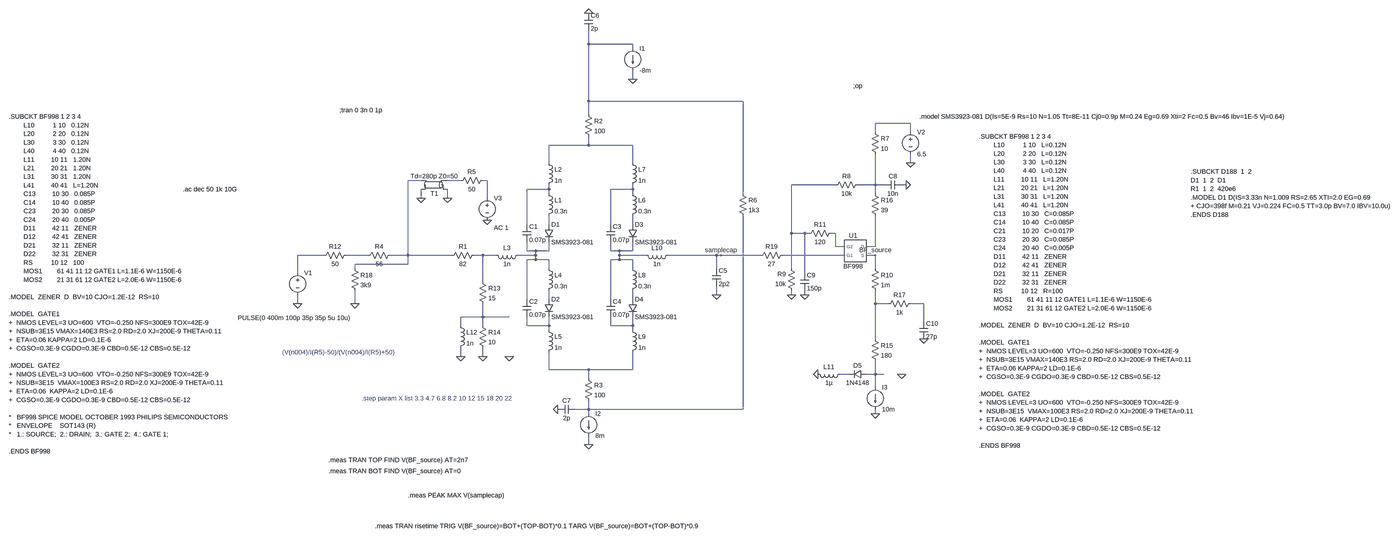
[diagram p0: schematic Draft17.asc, whole sheet]
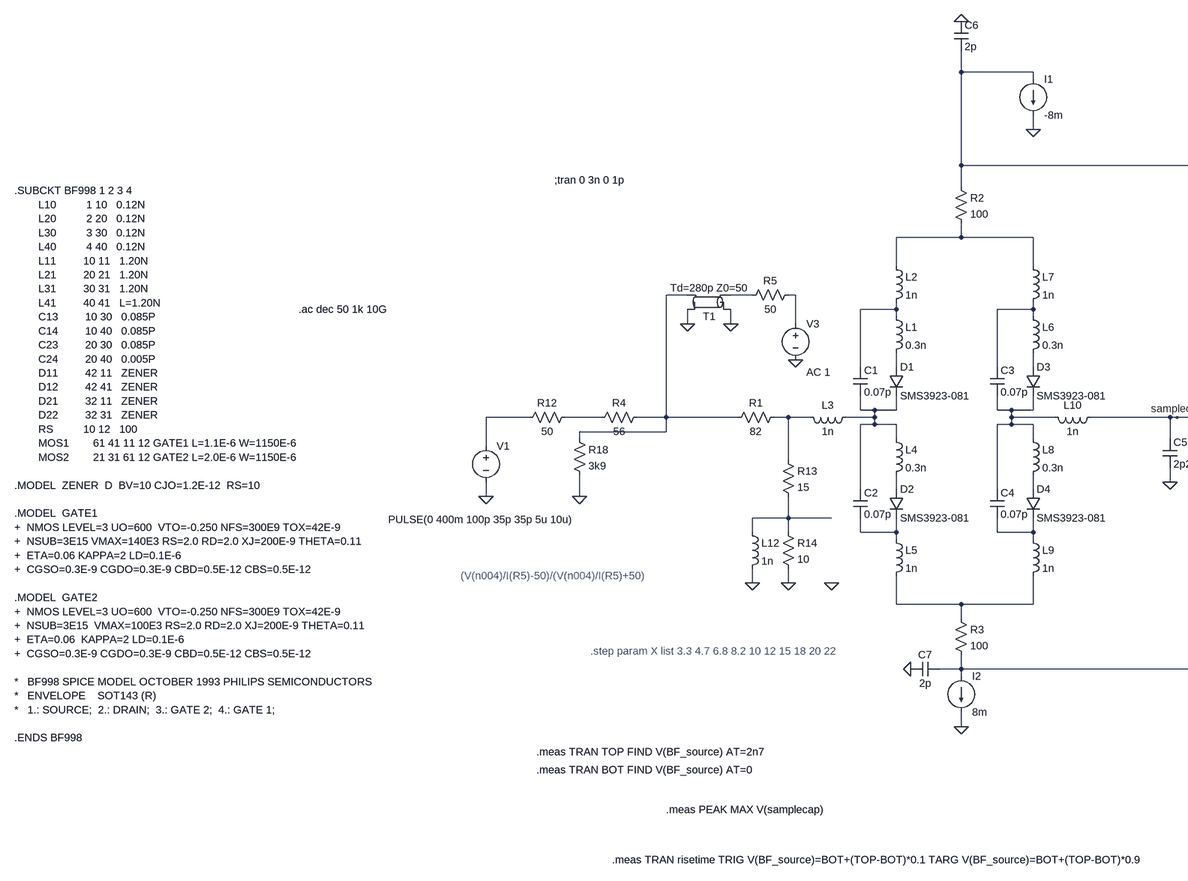
[diagram p1: schematic Draft17.asc, part, row 1 of 1, column 1 of 2]
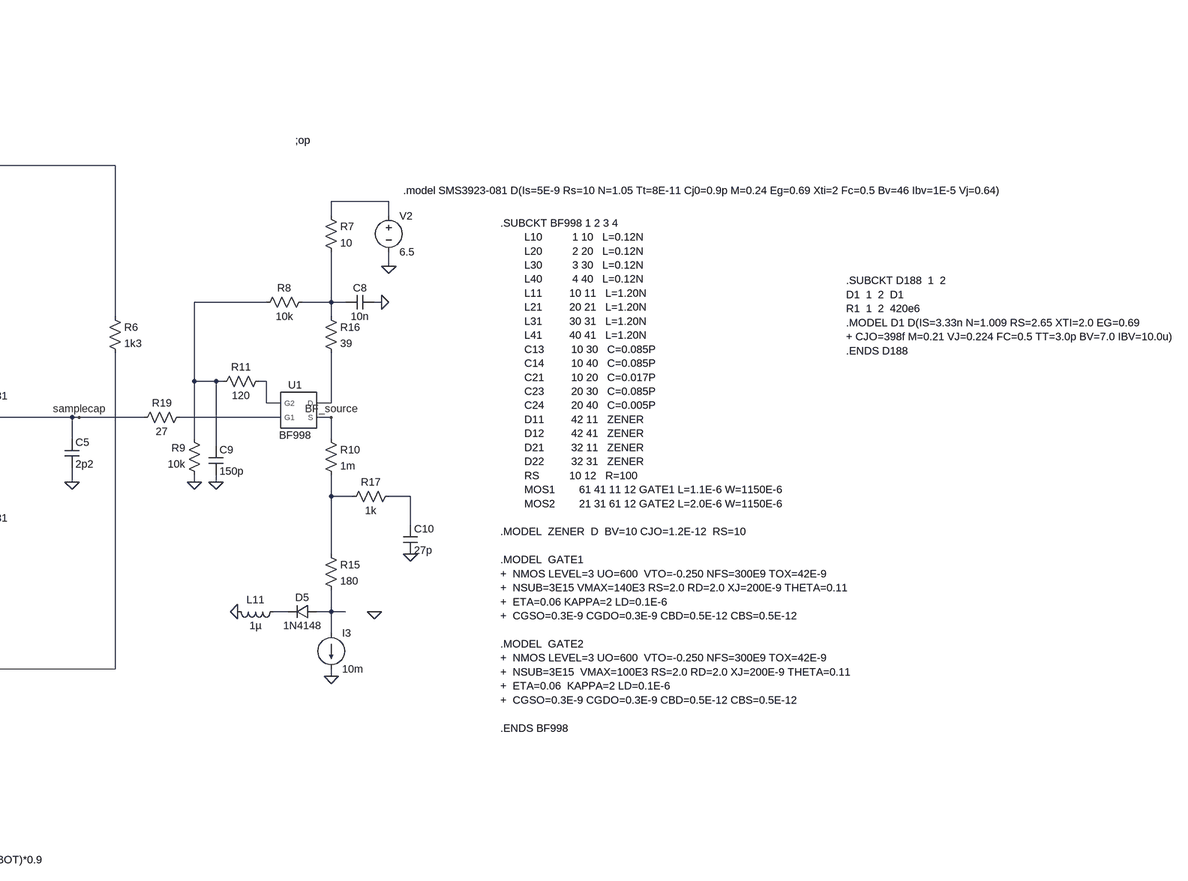
[diagram p2: schematic Draft17.asc, part, row 1 of 1, column 2 of 2]
Draft17.asc, the LTspice schematic file:
Version 4
SHEET 1 2144 1512
WIRE -832 -256 -832 -304
WIRE -672 -256 -832 -256
WIRE -672 -240 -672 -256
WIRE -672 -128 -672 -160
WIRE -832 -48 -832 -256
WIRE -272 -48 -832 -48
WIRE -832 0 -832 -48
WIRE 336 32 208 32
WIRE 208 64 208 32
WIRE 336 64 336 32
WIRE -832 112 -832 80
WIRE -832 112 -976 112
WIRE -672 112 -832 112
WIRE -976 176 -976 112
WIRE -672 176 -672 112
WIRE 336 176 336 144
WIRE -1440 240 -1488 240
WIRE -1296 240 -1344 240
WIRE -1200 240 -1216 240
WIRE 64 256 -96 256
WIRE 208 256 208 144
WIRE 208 256 144 256
WIRE 240 256 208 256
WIRE 320 256 304 256
WIRE -976 272 -976 256
WIRE -976 272 -1056 272
WIRE -672 272 -672 256
WIRE -672 272 -752 272
WIRE -976 288 -976 272
WIRE -672 288 -672 272
WIRE -272 288 -272 -48
WIRE 208 288 208 256
WIRE -1440 304 -1440 272
WIRE -1344 304 -1344 272
WIRE -1200 304 -1200 240
WIRE -1056 400 -1056 272
WIRE -976 400 -976 368
WIRE -752 400 -752 272
WIRE -672 400 -672 368
WIRE -96 432 -96 256
WIRE -48 432 -96 432
WIRE -32 432 -48 432
WIRE 64 432 48 432
WIRE 64 480 64 432
WIRE 96 480 64 480
WIRE 208 480 208 368
WIRE 208 480 176 480
WIRE -1056 496 -1056 464
WIRE -1024 496 -1056 496
WIRE -976 496 -976 464
WIRE -976 496 -1024 496
WIRE -752 496 -752 464
WIRE -720 496 -752 496
WIRE -672 496 -672 464
WIRE -672 496 -720 496
WIRE -1792 512 -1888 512
WIRE -1632 512 -1712 512
WIRE -1488 512 -1488 240
WIRE -1488 512 -1552 512
WIRE -1328 512 -1488 512
WIRE -1216 512 -1248 512
WIRE -1168 512 -1216 512
WIRE -1024 512 -1024 496
WIRE -1024 512 -1088 512
WIRE -720 512 -720 496
WIRE -624 512 -720 512
WIRE -368 512 -544 512
WIRE -352 512 -368 512
WIRE -208 512 -352 512
WIRE 96 512 -128 512
WIRE 208 512 176 512
WIRE -1024 528 -1024 512
WIRE -1024 528 -1056 528
WIRE -976 528 -1024 528
WIRE -720 528 -720 512
WIRE -720 528 -752 528
WIRE -672 528 -720 528
WIRE -1488 544 -1488 512
WIRE -1488 544 -1680 544
WIRE -1680 560 -1680 544
WIRE -976 560 -976 528
WIRE -672 560 -672 528
WIRE -368 560 -368 512
WIRE -96 560 -96 432
WIRE 208 560 208 512
WIRE -1888 576 -1888 512
WIRE -48 576 -48 432
WIRE -1216 608 -1216 512
WIRE -368 656 -368 624
WIRE -96 656 -96 640
WIRE -48 656 -48 640
WIRE -1056 672 -1056 528
WIRE -976 672 -976 640
WIRE -752 672 -752 528
WIRE -672 672 -672 640
WIRE -1888 688 -1888 656
WIRE -1680 688 -1680 640
WIRE 208 688 208 640
WIRE 256 688 208 688
WIRE 384 688 336 688
WIRE -1216 736 -1216 688
WIRE -1216 736 -1296 736
WIRE -1120 736 -1216 736
WIRE 384 752 384 688
WIRE -1296 768 -1296 736
WIRE -1216 768 -1216 736
WIRE -1056 768 -1056 736
WIRE -976 768 -976 736
WIRE -976 768 -1056 768
WIRE -752 768 -752 736
WIRE -672 768 -672 736
WIRE -672 768 -752 768
WIRE -976 784 -976 768
WIRE -672 784 -672 768
WIRE 208 816 208 688
WIRE -1296 880 -1296 848
WIRE -1216 880 -1216 848
WIRE -976 928 -976 864
WIRE -832 928 -976 928
WIRE -672 928 -672 864
WIRE -672 928 -832 928
WIRE 112 944 80 944
WIRE 208 944 208 896
WIRE 208 944 176 944
WIRE 240 944 208 944
WIRE -832 960 -832 928
WIRE 208 992 208 944
WIRE -832 1072 -832 1040
WIRE -832 1072 -880 1072
WIRE -272 1072 -272 368
WIRE -272 1072 -832 1072
WIRE -832 1088 -832 1072
WIRE 208 1088 208 1072
WIRE -832 1200 -832 1168
FLAG -368 656 0
FLAG -1888 688 0
FLAG -1440 304 0
FLAG -1344 304 0
FLAG -672 -128 0
FLAG -832 1200 0
FLAG -832 -368 0
FLAG -944 1072 0
FLAG -96 656 0
FLAG 320 256 0
FLAG -48 656 0
FLAG 336 176 0
FLAG 208 1088 0
FLAG -1216 880 0
FLAG -1296 880 0
FLAG 384 816 0
FLAG -352 512 samplecap
FLAG 304 944 0
FLAG 208 512 BF_source
FLAG 0 944 0
FLAG -1120 880 0
FLAG -1200 384 0
FLAG -1680 688 0
SYMBOL diode -992 400 R0
SYMATTR InstName D1
SYMATTR Value SMS3923-081
SYMBOL ind -992 272 R0
SYMATTR InstName L1
SYMATTR Value 0.3n
SYMBOL cap -1072 400 R0
SYMATTR InstName C1
SYMATTR Value 0.07p
SYMBOL ind -992 160 R0
SYMATTR InstName L2
SYMATTR Value 1n
SYMBOL ind -1072 496 R90
WINDOW 0 5 56 VBottom 2
WINDOW 3 32 56 VTop 2
SYMATTR InstName L3
SYMATTR Value 1n
SYMBOL diode -992 672 R0
SYMATTR InstName D2
SYMATTR Value SMS3923-081
SYMBOL ind -992 544 R0
SYMATTR InstName L4
SYMATTR Value 0.3n
SYMBOL cap -1072 672 R0
SYMATTR InstName C2
SYMATTR Value 0.07p
SYMBOL ind -992 768 R0
SYMATTR InstName L5
SYMATTR Value 1n
SYMBOL diode -688 400 R0
SYMATTR InstName D3
SYMATTR Value SMS3923-081
SYMBOL ind -688 272 R0
SYMATTR InstName L6
SYMATTR Value 0.3n
SYMBOL cap -768 400 R0
SYMATTR InstName C3
SYMATTR Value 0.07p
SYMBOL ind -688 160 R0
SYMATTR InstName L7
SYMATTR Value 1n
SYMBOL diode -688 672 R0
SYMATTR InstName D4
SYMATTR Value SMS3923-081
SYMBOL ind -688 544 R0
SYMATTR InstName L8
SYMATTR Value 0.3n
SYMBOL cap -768 672 R0
SYMATTR InstName C4
SYMATTR Value 0.07p
SYMBOL ind -688 768 R0
SYMATTR InstName L9
SYMATTR Value 1n
SYMBOL ind -528 496 R90
WINDOW 0 5 56 VBottom 2
WINDOW 3 32 56 VTop 2
SYMATTR InstName L10
SYMATTR Value 1n
SYMBOL cap -384 560 R0
SYMATTR InstName C5
SYMATTR Value 2p2
SYMBOL res -1232 496 R90
WINDOW 0 0 56 VBottom 2
WINDOW 3 32 56 VTop 2
SYMATTR InstName R1
SYMATTR Value 82
SYMBOL res -848 -16 R0
SYMATTR InstName R2
SYMATTR Value 100
SYMBOL res -848 944 R0
SYMATTR InstName R3
SYMATTR Value 100
SYMBOL voltage -1888 560 R0
WINDOW 123 0 0 Left 0
WINDOW 39 0 0 Left 0
WINDOW 3 -217 179 Left 2
SYMATTR Value PULSE(0 400m 100p 35p 35p 5u 10u)
SYMATTR InstName V1
SYMBOL res -1536 496 R90
WINDOW 0 0 56 VBottom 2
WINDOW 3 32 56 VTop 2
SYMATTR InstName R4
SYMATTR Value 56
SYMBOL tline -1392 256 R180
SYMATTR InstName T1
SYMATTR Value Td=280p Z0=50
SYMBOL current -672 -240 R0
WINDOW 123 0 0 Left 0
WINDOW 39 0 0 Left 0
SYMATTR InstName I1
SYMATTR Value -8m
SYMBOL current -832 1088 R0
WINDOW 123 0 0 Left 0
WINDOW 39 0 0 Left 0
SYMATTR InstName I2
SYMATTR Value 8m
SYMBOL cap -848 -368 R0
SYMATTR InstName C6
SYMATTR Value 2p
SYMBOL cap -944 1088 R270
WINDOW 0 32 32 VTop 2
WINDOW 3 0 32 VBottom 2
SYMATTR InstName C7
SYMATTR Value 2p
SYMBOL res -288 272 R0
SYMATTR InstName R6
SYMATTR Value 1k3
SYMBOL cap 304 240 R90
WINDOW 0 0 32 VBottom 2
WINDOW 3 32 32 VTop 2
SYMATTR InstName C8
SYMATTR Value 10n
SYMBOL res 192 48 R0
SYMATTR InstName R7
SYMATTR Value 10
SYMBOL res 160 240 R90
WINDOW 0 0 56 VBottom 2
WINDOW 3 32 56 VTop 2
SYMATTR InstName R8
SYMATTR Value 10k
SYMBOL res -80 656 R180
WINDOW 0 36 76 Left 2
WINDOW 3 36 40 Left 2
SYMATTR InstName R9
SYMATTR Value 10k
SYMBOL cap -64 576 R0
SYMATTR InstName C9
SYMATTR Value 150p
SYMBOL res 192 544 R0
SYMATTR InstName R10
SYMATTR Value 1m
SYMBOL voltage 336 48 R0
WINDOW 123 0 0 Left 0
WINDOW 39 0 0 Left 0
SYMATTR InstName V2
SYMATTR Value 6.5
SYMBOL current 208 992 R0
WINDOW 123 0 0 Left 0
WINDOW 39 0 0 Left 0
SYMATTR InstName I3
SYMATTR Value 10m
SYMBOL AutoGenerated\\BF998 128 496 R0
SYMATTR InstName U1
SYMBOL ind -1312 752 R0
SYMATTR InstName L12
SYMATTR Value 1n
SYMBOL res -1232 592 R0
SYMATTR InstName R13
SYMATTR Value 15
SYMBOL res -1696 496 R90
WINDOW 0 0 56 VBottom 2
WINDOW 3 32 56 VTop 2
SYMATTR InstName R12
SYMATTR Value 50
SYMBOL res -1232 752 R0
SYMATTR InstName R14
SYMATTR Value 10
SYMBOL diode 176 928 R90
WINDOW 0 0 32 VBottom 2
WINDOW 3 32 32 VTop 2
SYMATTR InstName D5
SYMATTR Value 1N4148
SYMBOL res 192 800 R0
SYMATTR InstName R15
SYMATTR Value 180
SYMBOL cap 368 752 R0
SYMATTR InstName C10
SYMATTR Value 27p
SYMBOL res 192 272 R0
SYMATTR InstName R16
SYMATTR Value 39
SYMBOL res 352 672 R90
WINDOW 0 0 56 VBottom 2
WINDOW 3 32 56 VTop 2
SYMATTR InstName R17
SYMATTR Value 1k
SYMBOL res -112 496 R90
WINDOW 0 0 56 VBottom 2
WINDOW 3 32 56 VTop 2
SYMATTR InstName R19
SYMATTR Value 27
SYMBOL res 64 416 R90
WINDOW 0 0 56 VBottom 2
WINDOW 3 32 56 VTop 2
SYMATTR InstName R11
SYMATTR Value 120
SYMBOL ind 96 928 R90
WINDOW 0 5 56 VBottom 2
WINDOW 3 32 56 VTop 2
SYMATTR InstName L11
SYMATTR Value 1µ
SYMBOL res -1200 224 R90
WINDOW 0 0 56 VBottom 2
WINDOW 3 32 56 VTop 2
SYMATTR InstName R5
SYMATTR Value 50
SYMBOL voltage -1200 288 R0
WINDOW 123 24 124 Left 2
WINDOW 39 0 0 Left 0
SYMATTR Value2 AC 1
SYMATTR InstName V3
SYMATTR Value ""
SYMBOL res -1696 544 R0
SYMATTR InstName R18
SYMATTR Value 3k9
TEXT 368 8 Left 2 !.model SMS3923-081 D(Is=5E-9 Rs=10 N=1.05 Tt=8E-11 Cj0=0.9p M=0.24 Eg=0.69 Xti=2 Fc=0.5 Bv=46 Ibv=1E-5 Vj=0.64)
TEXT 128 -104 Left 2 !;op
TEXT -1736 -16 Left 2 !;tran 0 3n 0 1p
TEXT 584 80 Left 2 !.SUBCKT BF998 1 2 3 4\n        L10          1 10   L=0.12N\n        L20          2 20   L=0.12N\n        L30          3 30   L=0.12N\n        L40          4 40   L=0.12N\n        L11         10 11   L=1.20N\n        L21         20 21   L=1.20N\n        L31         30 31   L=1.20N\n        L41         40 41   L=1.20N\n        C13         10 30   C=0.085P\n        C14         10 40   C=0.085P\n        C21         10 20   C=0.017P\n        C23         20 30   C=0.085P\n        C24         20 40   C=0.005P\n        D11         42 11   ZENER\n        D12         42 41   ZENER\n        D21         32 11   ZENER\n        D22         32 31   ZENER\n        RS          10 12   R=100\n        MOS1        61 41 11 12 GATE1 L=1.1E-6 W=1150E-6\n        MOS2        21 31 61 12 GATE2 L=2.0E-6 W=1150E-6\n \n.MODEL  ZENER  D  BV=10 CJO=1.2E-12  RS=10\n \n.MODEL  GATE1\n+  NMOS LEVEL=3 UO=600  VTO=-0.250 NFS=300E9 TOX=42E-9\n+  NSUB=3E15 VMAX=140E3 RS=2.0 RD=2.0 XJ=200E-9 THETA=0.11\n+  ETA=0.06 KAPPA=2 LD=0.1E-6\n+  CGSO=0.3E-9 CGDO=0.3E-9 CBD=0.5E-12 CBS=0.5E-12\n \n.MODEL  GATE2 \n+  NMOS LEVEL=3 UO=600  VTO=-0.250 NFS=300E9 TOX=42E-9\n+  NSUB=3E15  VMAX=100E3 RS=2.0 RD=2.0 XJ=200E-9 THETA=0.11\n+  ETA=0.06  KAPPA=2 LD=0.1E-6\n+  CGSO=0.3E-9 CGDO=0.3E-9 CBD=0.5E-12 CBS=0.5E-12\n \n.ENDS BF998
TEXT -2936 8 Left 2 !.SUBCKT BF998 1 2 3 4\n        L10          1 10   0.12N\n        L20          2 20   0.12N\n        L30          3 30   0.12N\n        L40          4 40   0.12N\n        L11         10 11   1.20N\n        L21         20 21   1.20N\n        L31         30 31   1.20N\n        L41         40 41   L=1.20N\n        C13         10 30   0.085P\n        C14         10 40   0.085P\n        C23         20 30   0.085P\n        C24         20 40   0.005P\n        D11         42 11   ZENER\n        D12         42 41   ZENER\n        D21         32 11   ZENER\n        D22         32 31   ZENER\n        RS          10 12   100\n        MOS1        61 41 11 12 GATE1 L=1.1E-6 W=1150E-6\n        MOS2        21 31 61 12 GATE2 L=2.0E-6 W=1150E-6\n \n.MODEL  ZENER  D  BV=10 CJO=1.2E-12  RS=10\n \n.MODEL  GATE1\n+  NMOS LEVEL=3 UO=600  VTO=-0.250 NFS=300E9 TOX=42E-9\n+  NSUB=3E15 VMAX=140E3 RS=2.0 RD=2.0 XJ=200E-9 THETA=0.11\n+  ETA=0.06 KAPPA=2 LD=0.1E-6\n+  CGSO=0.3E-9 CGDO=0.3E-9 CBD=0.5E-12 CBS=0.5E-12\n \n.MODEL  GATE2\n+  NMOS LEVEL=3 UO=600  VTO=-0.250 NFS=300E9 TOX=42E-9\n+  NSUB=3E15  VMAX=100E3 RS=2.0 RD=2.0 XJ=200E-9 THETA=0.11\n+  ETA=0.06  KAPPA=2 LD=0.1E-6\n+  CGSO=0.3E-9 CGDO=0.3E-9 CBD=0.5E-12 CBS=0.5E-12\n \n*   BF998 SPICE MODEL OCTOBER 1993 PHILIPS SEMICONDUCTORS\n*   ENVELOPE    SOT143 (R)\n*   1.: SOURCE;  2.: DRAIN;  3.: GATE 2;  4.: GATE 1;\n \n.ENDS BF998
TEXT -1656 1032 Left 2 ;.step param X list 3.3 4.7 6.8 8.2 10 12 15 18 20 22
TEXT -1776 1256 Left 2 !.meas TRAN TOP FIND V(BF_source) AT=2n7
TEXT -1776 1296 Left 2 !.meas TRAN BOT FIND V(BF_source) AT=0
TEXT -1608 1496 Left 2 !.meas TRAN risetime TRIG V(BF_source)=BOT+(TOP-BOT)*0.1 TARG V(BF_source)=BOT+(TOP-BOT)*0.9
TEXT -1488 1384 Left 2 !.meas PEAK MAX V(samplecap)
TEXT -2304 272 Left 2 !.ac dec 50 1k 10G
TEXT -1944 864 Left 2 ;(V(n004)/I(R5)-50)/(V(n004)/I(R5)+50)
TEXT 1352 208 Left 2 !.SUBCKT D188  1  2\nD1  1  2  D1\nR1  1  2  420e6\n.MODEL D1 D(IS=3.33n N=1.009 RS=2.65 XTI=2.0 EG=0.69\n+ CJO=398f M=0.21 VJ=0.224 FC=0.5 TT=3.0p BV=7.0 IBV=10.0u)\n.ENDS D188

The netlist it stands for:
* Draft17.asc
D1 N011 N015 SMS3923-081
L1 N009 N011 0.3n
C1 N009 N015 0.07p
L2 N003 N009 1n
L3 N015 N019 1n
D2 N021 N026 SMS3923-081
L4 N015 N021 0.3n
C2 N015 N026 0.07p
L5 N026 N028 1n
D3 N012 N016 SMS3923-081
L6 N010 N012 0.3n
C3 N010 N016 0.07p
L7 N003 N010 1n
D4 N022 N027 SMS3923-081
L8 N016 N022 0.3n
C4 N016 N027 0.07p
L9 N027 N028 1n
L10 samplecap N016 1n
C5 samplecap 0 2p2
R1 N019 N004 82
R2 N001 N003 100
R3 N028 N031 100
V1 N017 0 PULSE(0 400m 100p 35p 35p 5u 10u)
R4 N004 N018 56
T1 0 N005 0 N004 Td=280p Z0=50
I1 N001 0 -8m
I2 N031 0 8m
C6 0 N001 2p
C7 0 N031 2p
R6 N001 N031 1k3
C8 0 N008 10n
R7 N002 N008 10
R8 N008 N007 10k
R9 0 N007 10k
C9 N007 0 150p
R10 BF_source N023 1m
V2 N002 0 6.5
I3 N030 0 10m
XU1 BF_source N014 N013 N020 BF998  ; pins S D G2 G1
L12 N025 0 1n
R13 N019 N025 15
R12 N018 N017 50
R14 N025 0 10
D5 N030 N029 1N4148
R15 N023 N030 180
C10 N024 0 27p
R16 N008 N014 39
R17 N024 N023 1k
R19 N020 samplecap 27
R11 N013 N007 120
L11 N029 0 1µ
R5 N006 N005 50
V3 N006 0 AC 1
R18 N004 0 3k9
.model D D
.lib standard.dio
.model SMS3923-081 D(Is=5E-9 Rs=10 N=1.05 Tt=8E-11 Cj0=0.9p M=0.24 Eg=0.69 Xti=2 Fc=0.5 Bv=46 Ibv=1E-5 Vj=0.64)
;op
;tran 0 3n 0 1p
.SUBCKT BF998 1 2 3 4
        L10          1 10   L=0.12N
        L20          2 20   L=0.12N
        L30          3 30   L=0.12N
        L40          4 40   L=0.12N
        L11         10 11   L=1.20N
        L21         20 21   L=1.20N
        L31         30 31   L=1.20N
        L41         40 41   L=1.20N
        C13         10 30   C=0.085P
        C14         10 40   C=0.085P
        C21         10 20   C=0.017P
        C23         20 30   C=0.085P
        C24         20 40   C=0.005P
        D11         42 11   ZENER
        D12         42 41   ZENER
        D21         32 11   ZENER
        D22         32 31   ZENER
        RS          10 12   R=100
        MOS1        61 41 11 12 GATE1 L=1.1E-6 W=1150E-6
        MOS2        21 31 61 12 GATE2 L=2.0E-6 W=1150E-6
.MODEL  ZENER  D  BV=10 CJO=1.2E-12  RS=10
.MODEL  GATE1
+  NMOS LEVEL=3 UO=600  VTO=-0.250 NFS=300E9 TOX=42E-9
+  NSUB=3E15 VMAX=140E3 RS=2.0 RD=2.0 XJ=200E-9 THETA=0.11
+  ETA=0.06 KAPPA=2 LD=0.1E-6
+  CGSO=0.3E-9 CGDO=0.3E-9 CBD=0.5E-12 CBS=0.5E-12
.MODEL  GATE2
+  NMOS LEVEL=3 UO=600  VTO=-0.250 NFS=300E9 TOX=42E-9
+  NSUB=3E15  VMAX=100E3 RS=2.0 RD=2.0 XJ=200E-9 THETA=0.11
+  ETA=0.06  KAPPA=2 LD=0.1E-6
+  CGSO=0.3E-9 CGDO=0.3E-9 CBD=0.5E-12 CBS=0.5E-12
.ENDS BF998
.SUBCKT BF998 1 2 3 4
        L10          1 10   0.12N
        L20          2 20   0.12N
        L30          3 30   0.12N
        L40          4 40   0.12N
        L11         10 11   1.20N
        L21         20 21   1.20N
        L31         30 31   1.20N
        L41         40 41   L=1.20N
        C13         10 30   0.085P
        C14         10 40   0.085P
        C23         20 30   0.085P
        C24         20 40   0.005P
        D11         42 11   ZENER
        D12         42 41   ZENER
        D21         32 11   ZENER
        D22         32 31   ZENER
        RS          10 12   100
        MOS1        61 41 11 12 GATE1 L=1.1E-6 W=1150E-6
        MOS2        21 31 61 12 GATE2 L=2.0E-6 W=1150E-6
.MODEL  ZENER  D  BV=10 CJO=1.2E-12  RS=10
.MODEL  GATE1
+  NMOS LEVEL=3 UO=600  VTO=-0.250 NFS=300E9 TOX=42E-9
+  NSUB=3E15 VMAX=140E3 RS=2.0 RD=2.0 XJ=200E-9 THETA=0.11
+  ETA=0.06 KAPPA=2 LD=0.1E-6
+  CGSO=0.3E-9 CGDO=0.3E-9 CBD=0.5E-12 CBS=0.5E-12
.MODEL  GATE2
+  NMOS LEVEL=3 UO=600  VTO=-0.250 NFS=300E9 TOX=42E-9
+  NSUB=3E15  VMAX=100E3 RS=2.0 RD=2.0 XJ=200E-9 THETA=0.11
+  ETA=0.06  KAPPA=2 LD=0.1E-6
+  CGSO=0.3E-9 CGDO=0.3E-9 CBD=0.5E-12 CBS=0.5E-12
*   BF998 SPICE MODEL OCTOBER 1993 PHILIPS SEMICONDUCTORS
*   ENVELOPE    SOT143 (R)
*   1.: SOURCE;  2.: DRAIN;  3.: GATE 2;  4.: GATE 1;
.ENDS BF998
* .step param X list 3.3 4.7 6.8 8.2 10 12 15 18 20 22
.meas TRAN TOP FIND V(BF_source) AT=2n7
.meas TRAN BOT FIND V(BF_source) AT=0
.meas TRAN risetime TRIG V(BF_source)=BOT+(TOP-BOT)*0.1 TARG V(BF_source)=BOT+(TOP-BOT)*0.9
.meas PEAK MAX V(samplecap)
.ac dec 50 1k 10G
* (V(n004)/I(R5)-50)/(V(n004)/I(R5)+50)
.SUBCKT D188  1  2
D1  1  2  D1
R1  1  2  420e6
.MODEL D1 D(IS=3.33n N=1.009 RS=2.65 XTI=2.0 EG=0.69
+ CJO=398f M=0.21 VJ=0.224 FC=0.5 TT=3.0p BV=7.0 IBV=10.0u)
.ENDS D188
.lib Z:\home\msboss\Downloads\BF998.prm
.backanno
.end